# EAGLE design shield-gps (EAGLE 7.2.0)
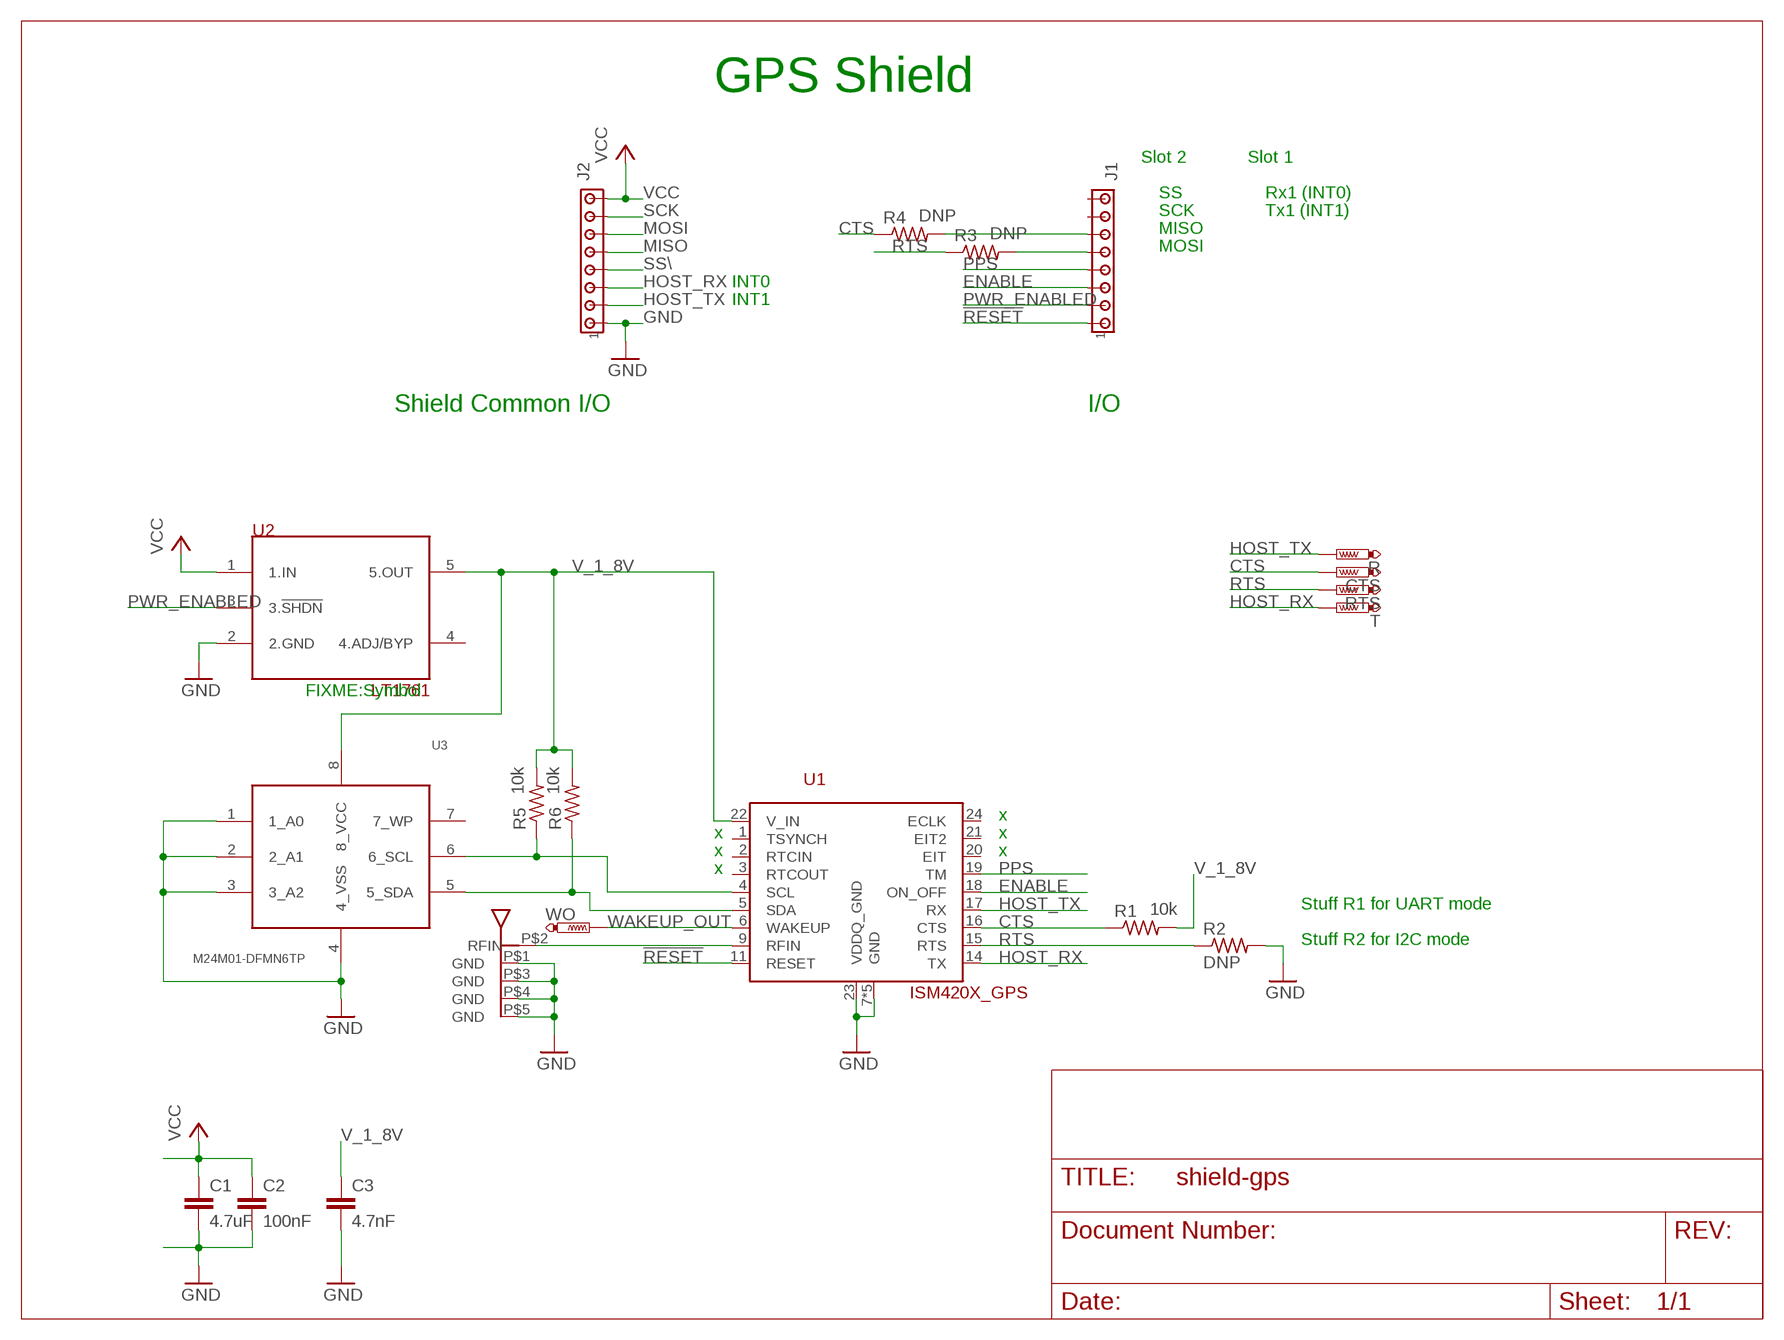
[diagram p0: schematic, sheet 1]

## Parts
ANT1  A10204_ANTENNA  [A10204_ANTENNA]
C1  4.7uF  C-EUC0603  [C0603]
C2  100nF  C-EUC0603  [C0603]
C3  4.7nF  C-EUC0603  [C0603]
CTS  PTR1PAD1-13  [P1-13]
J1  MTA08-100  [10X08MTA]
J2  MTA08-100  [10X08MTA]
R  PTR1PAD1-13  [P1-13]
R1  10k  R-US_R0603  [R0603]
R2  DNP  R-US_R0603  [R0603]
R3  DNP  R-US_R0603  [R0603]
R4  DNP  R-US_R0603  [R0603]
R5  10k  R-US_R0603  [R0603]
R6  10k  R-US_R0603  [R0603]
RTS  PTR1PAD1-13  [P1-13]
T  PTR1PAD1-13  [P1-13]
U1  ISM420X_GPS  [ISM420X_GPS]
U2  TC1016-1.85VCTTR  VREG_LT1761_SOT23-5  [SOT23-5]
U3  M24M01-DFMN6TP  24AA1025  [SO-8]
WO  PTR1PAD1-13  [P1-13]

## Nets
!RESET: J1.1 U1.11(RESET)
CTS: CTS.TP R1.1 R4.1 U1.16(CTS)
ENABLE: J1.3 U1.18(ON_OFF)
GND [pwr]: ANT1.P$1(GND) ANT1.P$3(GND) ANT1.P$4(GND) ANT1.P$5(GND) C1.2 C2.2 C3.2 J2.1 R2.2 U1.7(GND) U1.8(GND) U1.10(GND) U1.12(GND) U1.13(GND) U1.23(VDDQ_GND) U2.2(2.GND) U3.1(1_A0) U3.2(2_A1) U3.3(3_A2) U3.4(4_VSS)
HOST_RX: J2.3 T.TP U1.14(TX)
HOST_TX: J2.2 R.TP U1.17(RX)
MISO: J2.5
MOSI: J2.6
N$1: ANT1.P$2(RFIN) U1.9(RFIN)
N$2: J1.5 R3.2
N$3: R6.1 U1.5(SDA) U3.5(5_SDA)
N$4: R5.1 U1.4(SCL) U3.6(6_SCL)
N$5: J1.6 R4.2
PPS: J1.4 U1.19(TM)
PWR_ENABLED: J1.2 U2.3(3.!SHDN)
RTS: R2.1 R3.1 RTS.TP U1.15(RTS)
SCK: J2.7
SS\: J2.4
V_1_8V [pwr]: C3.1 R1.2 R5.2 R6.2 U1.22(V_IN) U2.5(5.OUT) U3.8(8_VCC)
VCC [pwr]: C1.1 C2.1 J2.8 U2.1(1.IN)
WAKEUP_OUT: U1.6(WAKEUP) WO.TP
Unconnected: J1.7 J1.8 U1.1(TSYNCH) U1.2(RTCIN) U1.3(RTCOUT) U1.20(EIT) U1.21(EIT2) U1.24(ECLK) U2.4(4.ADJ/BYP) U3.7(7_WP)

## Notes on the sheet
- GPS Shield
- Slot 2 | Slot 1
- SS | Rx1 (INT0)
- SCK | Tx1 (INT1)
- MISO
- MOSI
- INT0
- INT1
- Shield Common I/O | I/O
- FIXME:Symbol
- x
- x | x
- x | x
- x
- Stuff R1 for UART mode
- Stuff R2 for I2C mode

## Library data of the parts
ANT1 = tim:A10204_ANTENNA
C1-C3 = rcl:C-EU: CAPACITOR, European symbol
CTS R RTS T WO = testpad:PTR1: TEST PIN
J1 J2 = con-amp:MTA08-100: AMP connector
R1-R6 = rcl:R-US_: RESISTOR, American symbol
U1 = tim:ISM420X_GPS: ISM420R1-C33 GPS module for active or passive antenna. 20141223 / tgipson
U2 = aditya_main:VREG_LT1761
U3 = mideeval:24AA1025: Microchip 24AA1025/24LC1205/24FC1025 1024K 12C Serial EEPROM 2013.1.16 MMB

## Net classes
1 pwr: width 0.305 mm, drill 0.381 mm
4 digital: width 0.203 mm, drill 0.381 mm

## Board
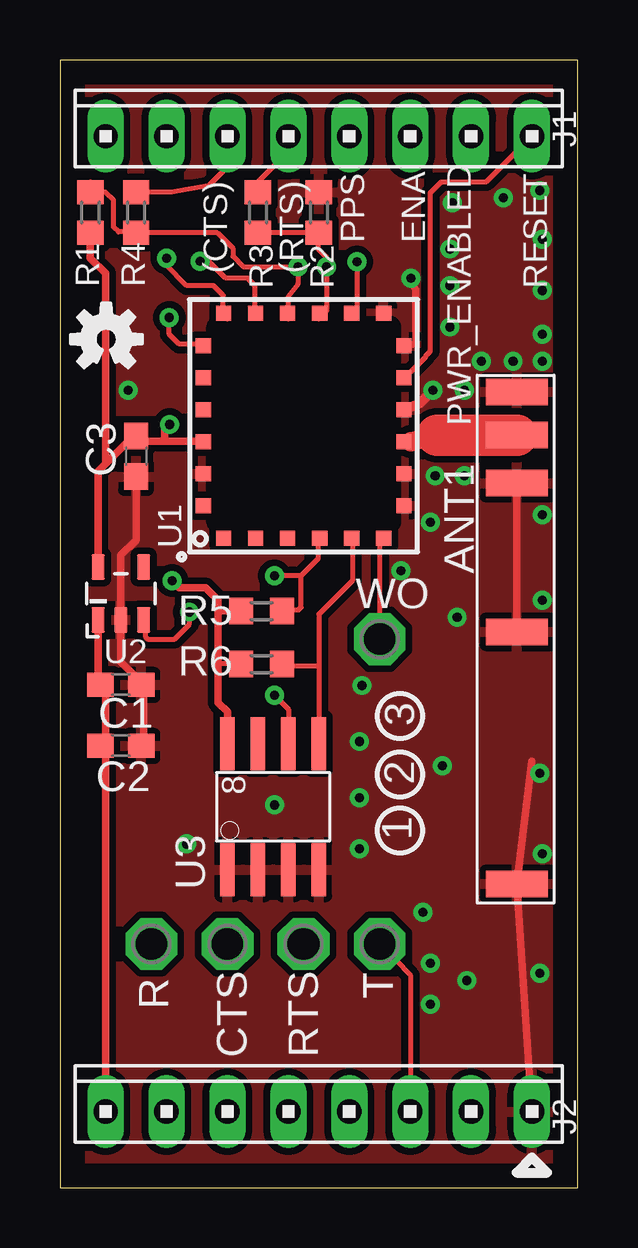
[diagram p1: board, top side]
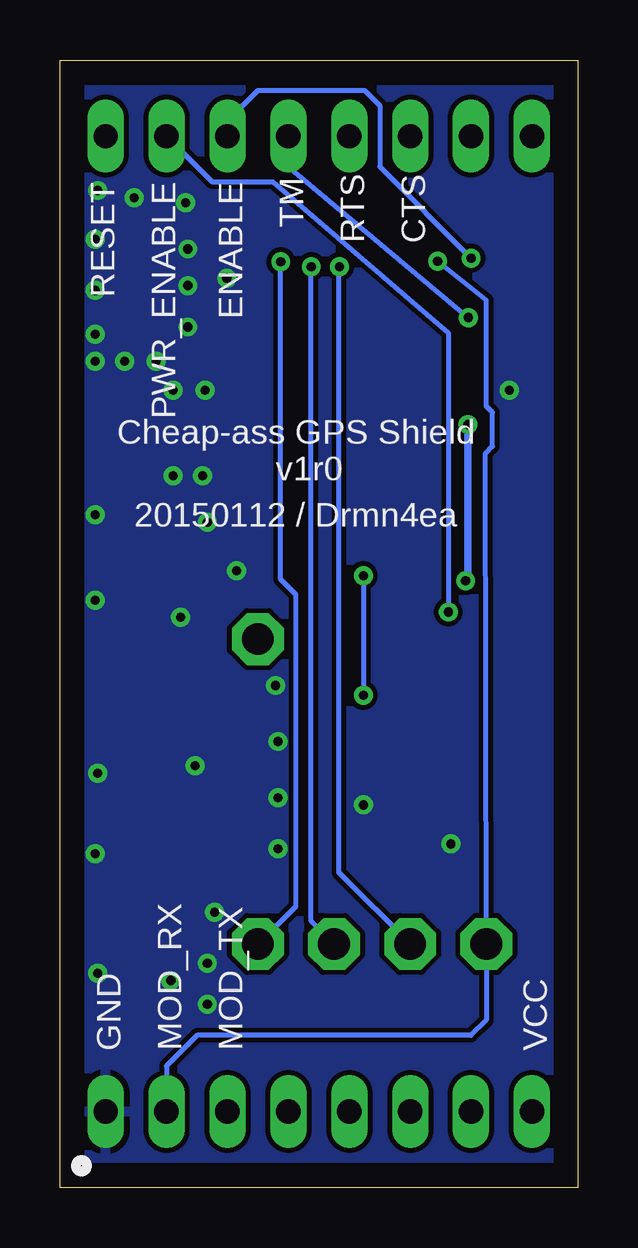
[diagram p2: board, bottom side, seen from below]

Size 21.59 x 46.99 mm. Coordinates in mm from the lower left corner, seen from the top.
Outline: 0,0 21.59,0 21.59,46.99 0,46.99 0,0
Copper layers (1*16): Top 0.035mm / dielectric 1.5mm / Bottom 0.035mm
Design rules "default": minimum track width 8mil, minimum drill 15mil, track to track 8mil, track to pad 8mil, pad to pad 8mil, via to via 8mil, smd to smd 8mil, copper to edge 40mil, drill to drill 8mil, minimum pad ring 10mil, minimum via ring 8mil, stop-mask expansion 4mil, vias tented up to drill 0mil, thermal gap 10mil
tRestrict: area 6.6,27.7 to 13.7,35.9

### Footprints (pad centres in the part's own frame; a part is rotated, then mirrored left to right if it is on the bottom)
A10204_ANTENNA = smd 1.1 x 2.6: P$1 -10.3,0; P$2 -8.5,0; P$3 -6.5,0; P$4 -0.3,0; P$5 10.2,0
C0603 = smd 1.1 x 1: 1 -0.85,0; 2 0.85,0
P1-13 = drill 1.321 pad 2.159 octagon: TP 0,0
10X08MTA = drill 1.016 long: 1 8.89,0; 2 6.35,0; 3 3.81,0; 4 1.27,0; 5 -1.27,0; 6 -3.81,0; 7 -6.35,0; 8 -8.89,0
R0603 = smd 1 x 1.1: 1 -0.85,0; 2 0.85,0
ISM420X_GPS = smd 0.635 x 0.635: 1 -4.682,3.337; 2 -4.682,2.002; 3 -4.682,0.666; 4 -4.682,-0.668; 5 -4.682,-2.003; 6 -4.682,-3.338; 7 -3.337,-4.181; 8 -2.002,-4.181; 9 -0.666,-4.181; 10 0.668,-4.181; 11 2.003,-4.181; 12 3.338,-4.181; 13 4.683,-3.338; 14 4.683,-2.003; 15 4.683,-0.668; 16 4.683,0.666; 17 4.683,2.002; 18 4.683,3.337; 19 3.338,4.181; 20 2.003,4.181; 21 0.668,4.181; 22 -0.666,4.181; 23 -2.002,4.181; 24 -3.337,4.181
SOT23-5 = smd 0.55 x 1.06: 1 -0.95,-1.1; 2 0,-1.1; 3 0.95,-1.1; 4 0.95,1.1; 5 -0.95,1.1
SO-8 = smd 0.61 x 2.21: 1 -1.905,-2.616; 2 -0.635,-2.616; 3 0.635,-2.616; 4 1.905,-2.616; 5 1.905,2.616; 6 0.635,2.616; 7 -0.635,2.616; 8 -1.905,2.616

### Placement (x,y rotation side)
ANT1  19.05,22.86 270 top
C1  2.54,20.95 0 top
C2  2.54,18.41 0 top
C3  3.17,30.48 270 top
CTS  6.99,10.16 90 top
J1  10.79,43.81 0 top
J2  10.79,3.17 0 top
LOGO1  OSHW-LOGOS  [OSHW-LOGO-S]  1.93,35.36 0 top
R  3.81,10.16 90 top
R1  1.27,40.64 270 top
R2  10.79,40.64 90 top
R3  8.26,40.64 90 top
R4  3.17,40.64 90 top
R5  8.41,24.03 180 top
R6  8.41,21.82 180 top
RTS  10.16,10.16 90 top
T  13.34,10.16 90 top
U1  10.16,31.75 90 top
U2  2.54,24.77 0 top
U3  8.89,15.88 0 top
WO  13.34,22.86 0 top

### Tracks (layer width: path | path; a pad name or v marks a point on that pad's centre or on a via)
!RESET
  Top 0.203: J1.1 17.78,41.91 15.9,41.91 15.44,41.45 15.44,34.85 15.24,34.65 15.24,34.61 14.61,33.97 U1.11
CTS  (via drill 0.38)
  Top 0.203: 1.27,41.91 R1.1 1.89,41.49 2.23,41.15 2.23,40.03 2.44,39.83 3.14,39.83 R4.1 6.57,39.79 7.21,39.14 7.21,38.81 7.64,38.38 v9.93,38.38 9.92,37.66 9.51,37.12 U1.16 9.53,36.2
  Bottom 0.203: v9.93,38.38 9.96,37.8 9.96,13.13 CTS.TP
ENABLE  (via drill 0.38)
  Top 0.203: 6.67,36.51 U1.18 6.99,36.2 6.81,36.37 6.81,37.19 6.4,37.59 5.28,37.59 4.45,38.43 v4.45,38.73
  Bottom 0.203: v4.45,38.73 8.26,42.55 8.26,45.09 8.89,45.72 13.34,45.72 14.61,44.45 J1.3
GND  (via drill 0.38)
  Top 0.305: 3.49,20.95 2.54,21.91 U2.2 2.54,26.35 3.17,26.99 C3.2 | 3.49,20.95 3.49,18.41 C2.2 | 3.49,20.95 C1.2 | J2.1 ANT1.P$5 19.68,17.78 | ANT1.P$3 ANT1.P$4 | U1.12 14.83,35.17 14.83,37.39 14.73,37.59 v14.63,37.9
  Top 0.406: U1.10 15.04,32.72 v15.54,33.22
  other vias: 16.36,41.05 15.65,29.67 16.87,29.67 15.44,27.74 14.22,25.7 16.56,23.77 12.6,20.93 15.95,17.58 12.5,16.26 12.5,14.12 15.14,11.48 15.44,9.35 15.44,7.65 16.97,8.64 20.02,8.94 12.5,18.59 20.12,34.44 18.9,34.44 17.58,34.44 16.87,33.22 20.12,28.04 20.12,35.56 20.12,37.39 20.12,39.52 20.02,41.55 18.49,41.25 16.26,39.12 16.26,37.59 16.26,35.86 8.94,15.95 2.84,33.22 20.12,13.92 20.02,17.27 20.12,24.49 5.28,14.33
  pour Bottom: -1.22,48.77 -1.22,-0.91 23.37,-0.91 23.37,48.77
  pour Top (isolate 0.279): -2.74,50.6 -2.74,-2.41 23.98,-2.41 23.98,50.6
HOST_RX  (via drill 0.38)
  Top 0.203: v12.38,38.58 12.38,36.51 U1.14 | J2.3 14.61,8.87 T.TP
  Bottom 0.203: v12.38,38.58 12.38,25.35 11.75,24.71 11.75,11.72 T.TP
HOST_TX  (via drill 0.38)
  Top 0.203: U1.17 7.94,36.51 8.13,36.51 8.13,37.59 7.82,37.9 6.91,37.9 6.2,38.61 v5.84,38.61
  Bottom 0.203: v5.84,38.61 3.81,36.98 3.81,32.56 3.56,32.31 3.56,30.89 3.86,30.58 R.TP 3.81,6.99 4.45,6.35 15.88,6.35 17.14,5.08 J2.2
N$1
  Top 0.203: 19.68,31.43 ANT1.P$2
  Top 0.61: 14.63,31.09 U1.9
  Top 0.813: 15.75,31.36 14.63,31.09
  Top 1.72: ANT1.P$2 15.75,31.36
N$2
  Top 0.203: J1.5 9.53,43.18 8.26,41.91 R3.2
N$3
  Top 0.203: U1.5 12.06,26.99 12.19,26.86 12.19,25.3 10.79,23.9 10.79,21.74 | 10.79,21.74 U3.5 | R6.1 9.33,21.74 10.79,21.74
N$4  (via drill 0.38)
  Top 0.203: U1.4 10.79,26.99 10.87,26.91 10.77,26.81 10.77,26.21 10.06,25.5 | 10.06,25.5 v8.94,25.5 | v8.94,20.52 9.53,19.94 U3.6 | R5.1 9.31,24.08 9.96,24.08 10.06,24.18 10.06,25.5
  Bottom 0.203: v8.94,25.5 v8.94,20.52
N$5
  Top 0.203: J1.6 6.99,42.55 6.2,41.76 4.66,41.49 R4.2
PPS  (via drill 0.38)
  Top 0.203: U1.19 5.91,35.15 4.98,35.15 4.56,35.57 v4.56,36.26
  Bottom 0.203: v4.56,36.26 12.06,42.55 J1.4
PWR_ENABLED  (via drill 0.38)
  Top 0.203: U2.3 3.49,23.81 3.56,23.75 3.56,22.96 3.66,22.86 4.78,22.86 5.4,23.48 v5.4,23.99
  Bottom 0.203: v5.4,23.99 5.4,35.62 12.7,41.91 15.24,41.91 J1.2
RTS  (via drill 0.38)
  Top 0.203: 10.79,36.2 U1.15 11.11,36.51 v11.11,38.38 11.11,38.77 10.77,39.12 10.77,39.77 | R2.1 10.77,39.77 | 10.77,39.77 10.74,39.79 R3.1
  Bottom 0.203: v11.11,38.38 11.11,11.11 RTS.TP
V_1_8V  (via drill 0.38)
  Top 0.203: R5.2 7.53,23.98 6.6,23.98 | R6.2 7.51,21.84 6.6,21.84
  Top 0.305: 4.37,31.11 3.17,31.11 C3.1 3.17,31.43 1.91,30.16 | 4.37,31.11 5.71,31.11 U1.22 | 1.91,30.16 1.59,29.84 1.59,26.04 U2.5 | 1.91,30.16 1.91,38.1 1.27,38.73 R1.2 | v4.67,25.3 4.98,24.99 6.08,24.99 6.6,24.47 6.6,23.98 6.6,21.84 6.6,20.22 6.99,19.84 U3.8 | v4.57,31.8 4.37,31.6 4.37,31.11
  Bottom 0.305: v4.67,25.3 4.57,25.4 v4.57,31.8
VCC
  Top 0.305: U2.1 1.59,23.5 1.59,20.95 C1.1 1.91,20.95 1.91,18.41 | J2.8 1.91,18.41 | 1.91,18.41 C2.1
WAKEUP_OUT
  Top 0.203: WO.TP 13.34,26.99 U1.6

### Text on the board
tPlace: PPS | ENA | (CTS) | (RTS) | RESET | PWR_ENABLED
bPlace: PWR_ENABLE | RESET | TM | CTS | RTS | ENABLE | Cheap-ass GPS Shield | v1r0 | 20150112 / Drmn4ea | VCC | MOD_TX | MOD_RX | GND
tNames: U2 | 3 | 2 | 1
Reference: Vcc | Rx1 | Tx1 | Gnd